# EAGLE design IRAMX-drv-v1 (EAGLE 6.5.0)
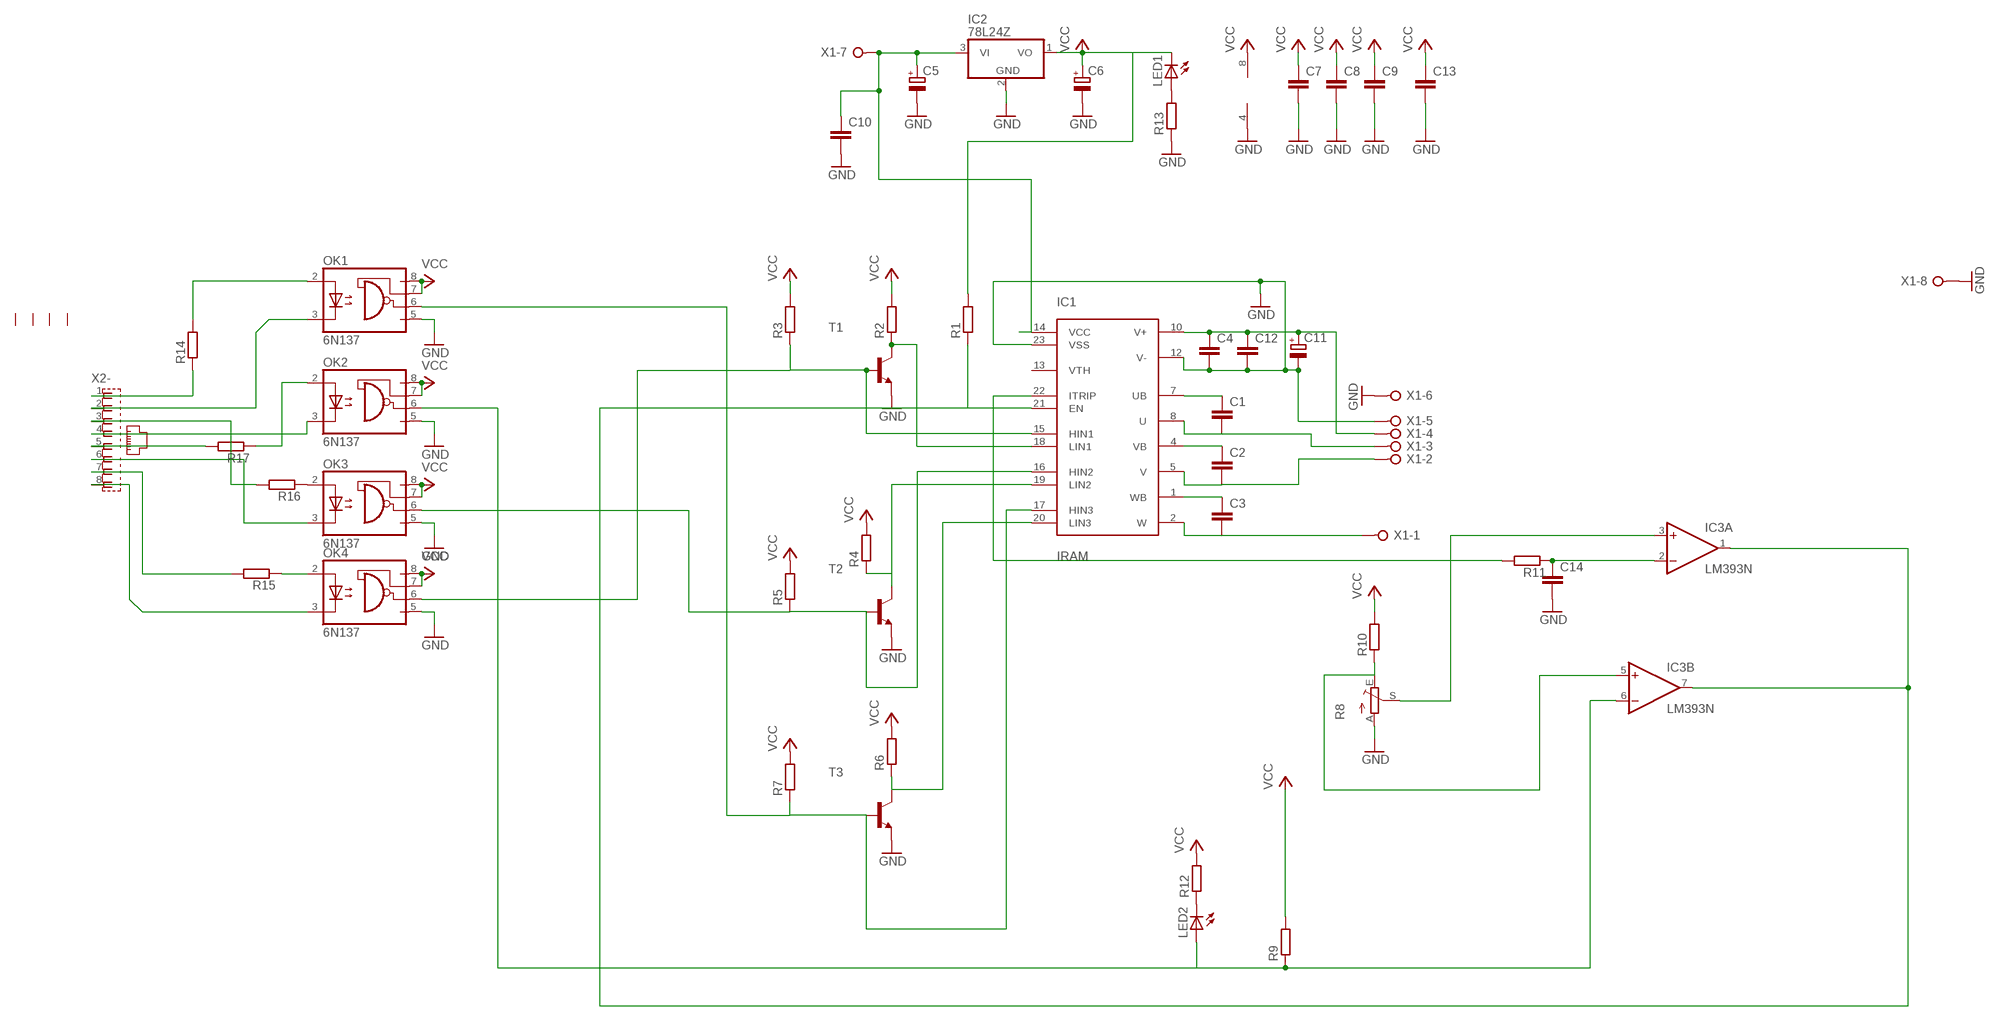
[diagram p0: schematic, sheet 1]

## Parts
C1  C5/5  [C5B5]
C2  C5/5  [C5B5]
C3  C5/5  [C5B5]
C4  C5/5  [C5B5]
C5  CPOL-EUE2.5-5  [E2,5-5]
C6  CPOL-EUE2.5-5  [E2,5-5]
C7  C-EU050-025X075  [C050-025X075]
C8  C-EU050-025X075  [C050-025X075]
C9  C-EU050-025X075  [C050-025X075]
C10  C-EU050-025X075  [C050-025X075]
C11  CPOL-EUE10-25  [EB25D]
C12  C-EU150-054X183  [C150-054X183]
C13  C-EU050-025X075  [C050-025X075]
C14  C-EU050-025X075  [C050-025X075]
IC1  IRAM  [SIP23]
IC2  78L24Z  [TO92]
IC3  LM393N  [DIL08]
LED1  LED5MM  [LED5MM]
LED2  LED5MM  [LED5MM]
OK1  6N137  [DIL08]
OK2  6N137  [DIL08]
OK3  6N137  [DIL08]
OK4  6N137  [DIL08]
R1  R-EU_0204/7  [0204/7]
R2  R-EU_0204/7  [0204/7]
R3  R-EU_0204/7  [0204/7]
R4  R-EU_0204/7  [0204/7]
R5  R-EU_0204/7  [0204/7]
R6  R-EU_0204/7  [0204/7]
R7  R-EU_0204/7  [0204/7]
R8  TRIM_EU-CA6V  [CA6V]
R9  R-EU_0204/7  [0204/7]
R10  R-EU_0204/7  [0204/7]
R11  R-EU_0204/7  [0204/7]
R12  R-EU_0204/7  [0204/7]
R13  R-EU_0204/7  [0204/7]
R14  R-EU_0204/2V  [0204V]
R15  R-EU_0204/2V  [0204V]
R16  R-EU_0204/2V  [0204V]
R17  R-EU_0204/2V  [0204V]
T1  BC547-NPN-TO92-CBE  [TO92-CBE]
T2  BC547-NPN-TO92-CBE  [TO92-CBE]
T3  BC547-NPN-TO92-CBE  [TO92-CBE]
X1  W237-08P  [W237-8P]
X2  RJ45  [RJ45]

## Nets
GND: C4.2 C5.- C6.- C7.2 C8.2 C9.2 C10.2 C11.- C12.2 C13.2 C14.2 IC1.12(V-) IC1.23(VSS) IC2.2(GND) IC3.4(P:V-) OK1.5(GND) OK2.5(GND) OK3.5(GND) OK4.5(GND) R8.A R13.1 T1.E T2.E T3.E X1.5 X1.6 X1.8
N$1: C1.1 IC1.7(UB)
N$2: C1.2 IC1.8(U) X1.3
N$3: C2.1 IC1.4(VB)
N$4: C2.2 IC1.5(V) X1.2
N$5: C3.1 IC1.1(WB)
N$6: C3.2 IC1.2(W) X1.1
N$7: LED2.K(C) R12.1
N$8: C14.1 IC3.2(A:-IN) R11.1
N$9: C5.+ C10.1 IC1.14(VCC) IC2.3(VI) X1.7
N$10: IC1.21(EN) IC3.1(A:OUT) IC3.7(B:OUT) R1.1
N$11: IC1.15(HIN1) OK4.6(VO) R3.1 T1.B
N$12: IC1.18(LIN1) R2.1 T1.C
N$13: IC1.19(LIN2) R4.1 T2.C
N$14: IC1.16(HIN2) OK3.6(VO) R5.1 T2.B
N$15: IC1.20(LIN3) R6.1 T3.C
N$16: OK3.3(C) X2.6
N$17: R16.2 X2.3
N$18: OK4.3(C) X2.8
N$19: OK2.3(C) X2.4
N$20: OK1.3(C) X2.2
N$21: OK1.2(A) R14.2
N$22: R17.2 X2.5
N$23: R15.2 X2.7
N$24: IC1.17(HIN3) OK1.6(VO) R7.1 T3.B
N$25: IC3.3(A:+IN) R8.S
N$26: IC1.22(ITRIP) R11.2
N$27: IC3.5(B:+IN) R8.E R10.1
N$28: LED1.A R13.2
N$29: IC3.6(B:-IN) LED2.A OK2.6(VO) R9.1
N$30: C4.1 C11.+ C12.1 IC1.10(V+) X1.4
N$31: R14.1 X2.1
N$32: OK4.2(A) R15.1
N$33: OK3.2(A) R16.1
N$34: OK2.2(A) R17.1
VCC: C6.+ C7.1 C8.1 C9.1 C13.1 IC2.1(VO) IC3.8(P:V+) LED1.K(C) OK1.7(VE) OK1.8(VCC) OK2.7(VE) OK2.8(VCC) OK3.7(VE) OK3.8(VCC) OK4.7(VE) OK4.8(VCC) R1.2 R2.2 R3.2 R4.2 R5.2 R6.2 R7.2 R9.2 R10.2 R12.2
Unconnected: IC1.13(VTH) X2.G1 X2.G2 X2.G3 X2.G4

## Library data of the parts
C1-C4 = capacitor-wima:C: CAPACITOR naming: grid - package width
C5 C6 C11 = rcl:CPOL-EU: POLARIZED CAPACITOR, European symbol
C7-C10 C12-C14 = rcl:C-EU: CAPACITOR, European symbol
IC1 = iram-b:IRAM
IC2 = linear:78*: Positive VOLTAGE REGULATOR Source: http://cache.national.com/ds/LM/LM78L05.pdf http://www.fairchildsemi.com/ds/LM/LM7805.pdf
IC3 = linear:LM393: COMPARATOR
LED1 LED2 = led:LED: LED OSRAM: - CHIPLED LG R971, LG N971, LY N971, LG Q971, LY Q971, LO R971, LY R971 LH N974, LH R974 LS Q976, LO Q976, LY Q976 LO Q996 - Hyper CHIPLED LW Q18S LB Q993, LB Q99A, LB R99A - SideLED LS A670, LO A670, LY A670, LG A670, LP A670 LB A673, LV A673, LT A673, LW A673 LH A674 LY A675 LS A676, LA A676, LO A676, LY A676, LW A676 LS A679, LY A679, LG A679 - Hyper Micro SIDELED® LS Y876, LA Y876, LO Y876, LY Y876 LT Y87S - SmartLED LW L88C, LW L88S LB L89C, LB L89S, LG L890 LS L89K, LO L89K, LY L89K LS L896, LA L896, LO L896, LY L896 - TOPLED LS T670, LO T670, LY T670, LG T670, LP T670 LSG T670, LSP T670, LSY T670, LOP T670, LYG T670 LG T671, LOG T671, LSG T671 LB T673, LV T673, LT T673, LW T673 LH T674 LS T676, LA T676, LO T676, LY T676, LB T676, LH T676, LSB T676, LW T676 LB T67C, LV T67C, LT T67C, LS T67K, LO T67K, LY T67K, LW E67C LS E67B, LA E67B, LO E67B, LY E67B, LB E67C, LV E67C, LT E67C LW T67C LS T679, LY T679, LG T679 LS T770, LO T770, LY T770, LG T770, LP T770 LB T773, LV T773, LT T773, LW T773 LH T774 LS E675, LA E675, LY E675, LS T675 LS T776, LA T776, LO T776, LY T776, LB T776 LHGB T686 LT T68C, LB T68C - Hyper Mini TOPLED® LB M676 - Mini TOPLED Santana® LG M470 LS M47K, LO M47K, LY M47K Source: http://www.osram.convergy.de LUXEON: - LUMILED® LXK2-PW12-R00, LXK2-PW12-S00, LXK2-PW14-U00, LXK2-PW14-V00 LXK2-PM12-R00, LXK2-PM12-S00, LXK2-PM14-U00 LXK2-PE12-Q00, LXK2-PE12-R00, LXK2-PE12-S00, LXK2-PE14-T00, LXK2-PE14-U00 LXK2-PB12-K00, LXK2-PB12-L00, LXK2-PB12-M00, LXK2-PB14-N00, LXK2-PB14-P00, LXK2-PB14-Q00 LXK2-PR12-L00, LXK2-PR12-M00, LXK2-PR14-Q00, LXK2-PR14-R00 LXK2-PD12-Q00, LXK2-PD12-R00, LXK2-PD12-S00 LXK2-PH12-R00, LXK2-PH12-S00 LXK2-PL12-P00, LXK2-PL12-Q00, LXK2-PL12-R00 Source: www.luxeon.com KINGBRIGHT: KA-3528ASYC Source: www.kingbright.com
OK1-OK4 = optocoupler:6N137: MOTOROLA OPTO COUPLER; MPN: 6N137; OC_FARNELL: 1328376; OC_NEWARK: 52M1895
R1-R7 R9-R17 = rcl:R-EU_: RESISTOR, European symbol
R8 = pot:TRIM_EU-: POTENTIOMETER
T1-T3 = transistor:*-NPN-: NPN Transistror BF959 corrected 2008.03.06
X1 = con-wago-508:W237-08P: WAGO SREW CLAMP; OC_FARNELL: unknown; OC_NEWARK: unknown
X2 = con-appsys:RJ45: AMP connector

## Board
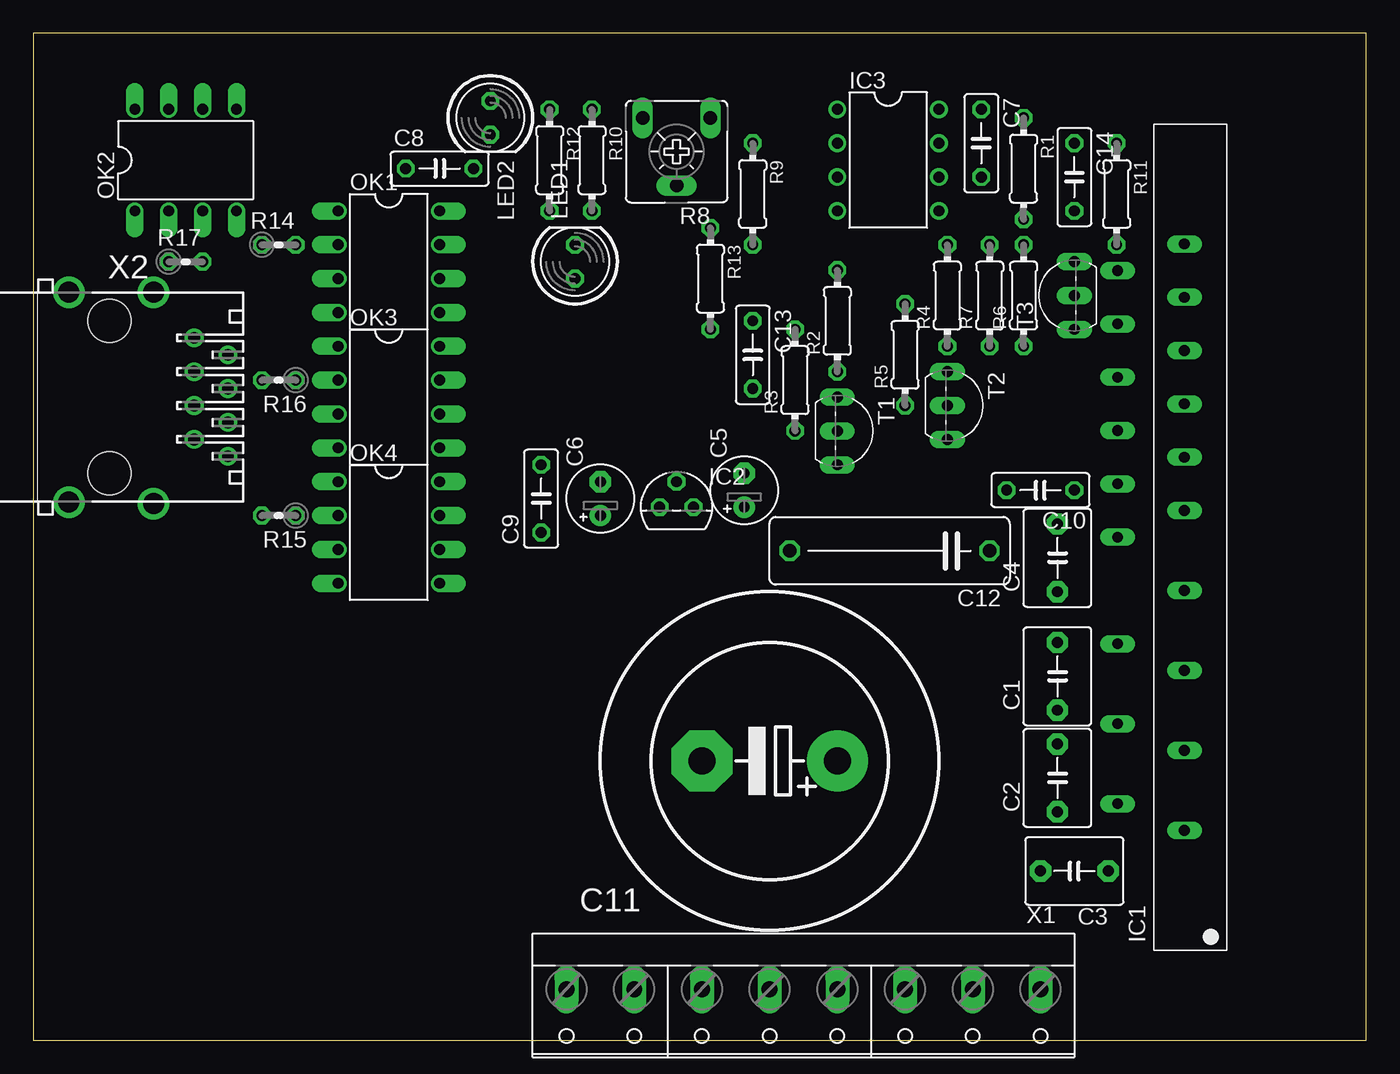
[diagram p1: board, top side]
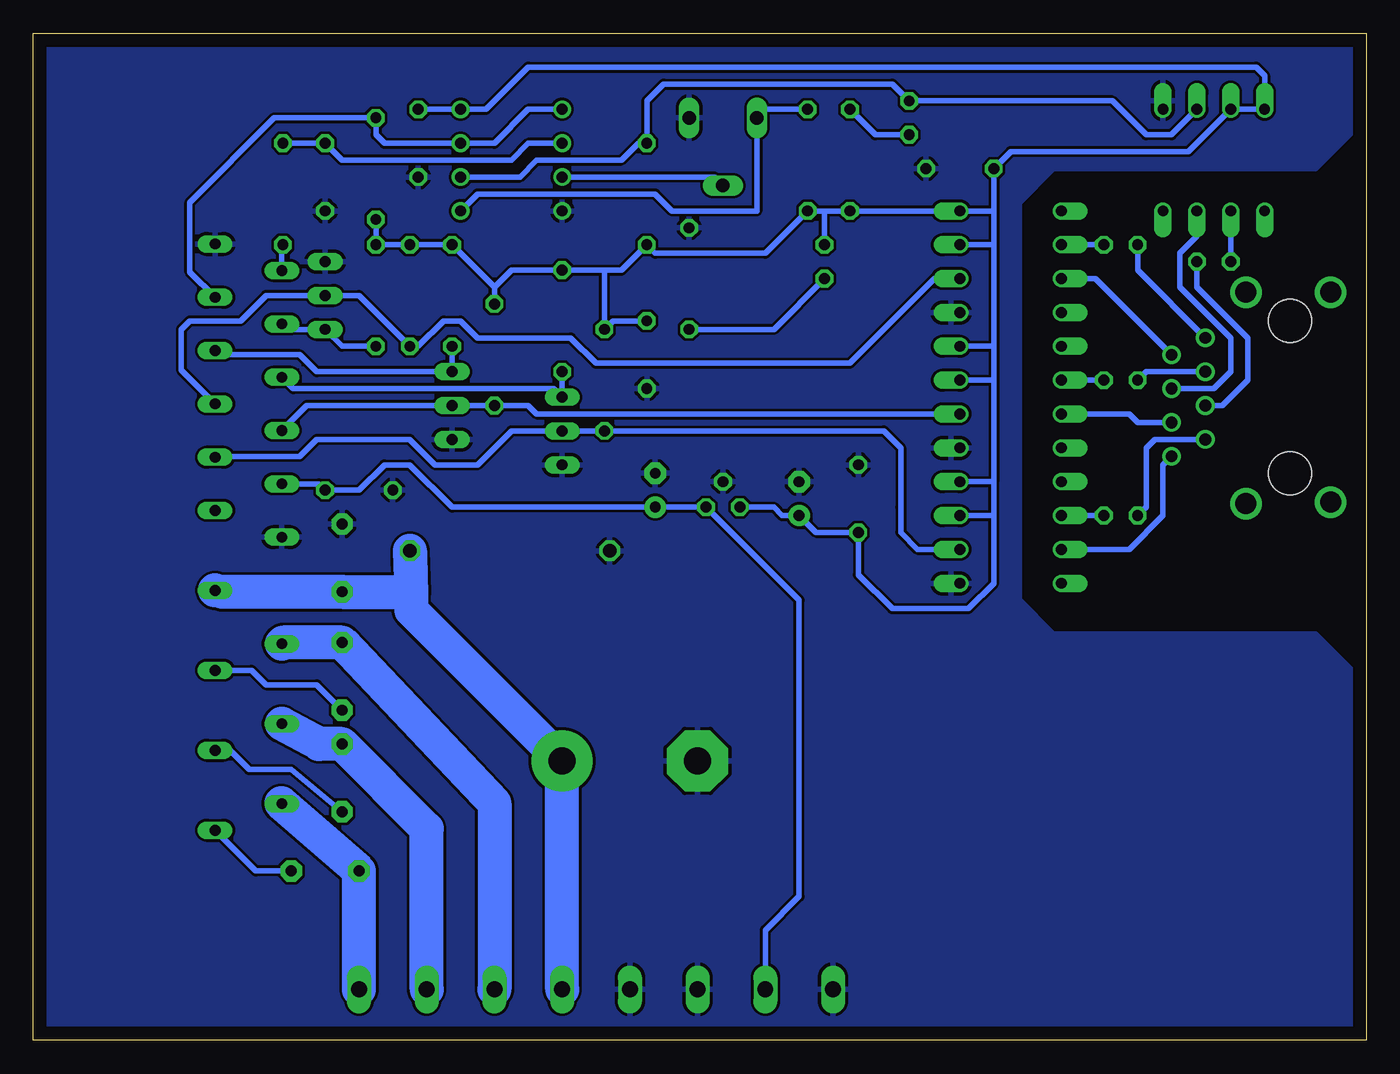
[diagram p2: board, bottom side, seen from below]

Size 100 x 75.56 mm. Coordinates in mm from the lower left corner, seen from the top.
Outline: 0,0 100,0 100,75.56 0,75.56 0,0
Copper layers (1*16): Top 0.035mm / dielectric 1.5mm / Bottom 0.035mm
Design rules "default": minimum track width 10mil, minimum drill 24mil, track to track 8mil, track to pad 8mil, pad to pad 8mil, via to via 8mil, smd to smd 8mil, copper to edge 40mil, drill to drill 8mil, minimum pad ring 10mil, minimum via ring 8mil, stop-mask expansion 4mil, vias tented up to drill 0mil, thermal gap 10mil

### Footprints (pad centres in the part's own frame; a part is rotated, then mirrored left to right if it is on the bottom)
C5B5 = drill 0.813 pad 1.6 octagon: 1 -2.54,0; 2 2.54,0
E2,5-5 = drill 0.813 pad 1.6: + -1.27,0 | drill 0.813 pad 1.6 octagon: - 1.27,0
C050-025X075 = drill 0.813 octagon: 1 -2.54,0; 2 2.54,0
EB25D = drill 2.007 pad 4.597: + -5.08,0 | drill 2.007 pad 4.597 octagon: - 5.08,0
C150-054X183 = drill 1.016 octagon: 1 -7.493,0; 2 7.493,0
SIP23 = drill 0.8 long: 1 -16,0; 2 -14,5; 4 -10,0; 5 -8,5; 7 -4,0; 8 -2,5; 10 2,0; 12 6,5; 13 8,0; 14 10,5; 15 12,0; 16 14,5; 17 16,0; 18 18,5; 19 20,0; 20 22,5; 21 24,0; 22 26,5; 23 28,0
TO92 = drill 0.813 octagon: 1 -1.27,0; 2 0,1.905; 3 1.27,0
DIL08 = drill 0.813 pad 1.27: 1 -3.81,-3.81; 2 -1.27,-3.81; 3 1.27,-3.81; 4 3.81,-3.81; 5 3.81,3.81; 6 1.27,3.81; 7 -1.27,3.81; 8 -3.81,3.81
LED5MM = drill 0.813 octagon: A -1.27,0; K 1.27,0
DIL08' = drill 0.813 offset: 1 -3.81,-3.81; 2 -1.27,-3.81; 3 1.27,-3.81; 4 3.81,-3.81; 5 3.81,3.81; 6 1.27,3.81; 7 -1.27,3.81; 8 -3.81,3.81
0204/7 = drill 0.813 octagon: 1 -3.81,0; 2 3.81,0
CA6V = drill 1.016 long: A -2.54,-2.54; E 2.54,-2.54; S 0,2.54
0204V = drill 0.813 octagon: 1 -1.27,0; 2 1.27,0
TO92-CBE = drill 0.813 long: B 0,0; C -2.54,0; E 2.54,0
W237-8P = drill 1.194 long: 1 -17.78,-0.635; 2 -12.7,-0.635; 3 -7.62,-0.635; 4 -2.54,-0.635; 5 2.54,-0.635; 6 7.62,-0.635; 7 12.7,-0.635; 8 17.78,-0.635
RJ45 = drill 0.889: 1 -4.445,6.35; 2 -3.175,8.89; 3 -1.905,6.35; 4 -0.635,8.89; 5 0.635,6.35; 6 1.905,8.89; 7 3.175,6.35; 8 4.445,8.89 | drill 1.575 pad 2.184: G1 -7.874,-3.048; G2 7.874,-3.048; G3 -7.874,3.302; G4 8.001,3.302 | hole 3.251: -5.715,0; 5.715,0

### Placement (x,y rotation side)
C1  76.83,27.3 90 top
C2  76.83,19.68 90 top
C3  78.11,12.7 180 top
C4  76.83,36.2 90 top
C5  53.34,41.27 90 top
C6  42.55,40.64 90 top
C7  71.12,67.31 270 top
C8  30.48,65.41 0 top
C9  38.1,40.64 90 top
C10  75.56,41.27 180 top
C11  55.24,20.95 180 top
C12  64.24,36.72 180 top
C13  53.98,51.44 270 top
C14  78.11,64.77 270 top
IC1  86.36,31.75 90 top
IC2  48.26,40.01 0 top
IC3  64.14,66.04 270 top
LED1  40.64,58.42 90 top
LED2  34.29,69.22 270 top
OK1  6N137  [DIL08']  26.67,58.42 270 top
OK2  6N137  [DIL08']  11.43,66.04 0 top
OK3  6N137  [DIL08']  26.67,48.26 270 top
OK4  6N137  [DIL08']  26.67,38.1 270 top
R1  74.3,65.41 270 top
R2  60.33,53.98 90 top
R3  57.15,49.53 90 top
R4  68.58,55.88 90 top
R5  65.41,51.44 90 top
R6  74.3,55.88 90 top
R7  71.75,55.88 90 top
R8  48.26,66.67 180 top
R9  53.98,63.5 270 top
R10  41.91,66.04 270 top
R11  81.28,63.5 270 top
R12  38.73,66.04 270 top
R13  50.8,57.15 270 top
R14  18.41,59.69 0 top
R15  18.41,39.37 180 top
R16  18.41,49.53 180 top
R17  11.43,58.42 0 top
T1  60.33,45.72 270 top
T2  68.58,47.62 270 top
T3  78.11,55.88 90 top
X1  57.78,3.17 180 top
X2  5.71,48.26 270 top

### Tracks (layer width: path | path; a pad name or v marks a point on that pad's centre or on a via)
GND
  pour Bottom: 0,75.56 100.33,75.56 100.33,0 0,0 0,26.67 3.81,30.48 23.5,30.48 26.04,33.02 26.04,62.87 23.5,65.41 3.81,65.41 0,69.22
N$1
  Bottom 0.406: IC1.7 83.63,27.75 82.55,26.67 78.74,26.67 C1.1
N$2
  Bottom 2.54: X1.3 65.41,17.78 C1.2 81.27,29.84 IC1.8
N$3
  Bottom 0.406: IC1.4 85.25,21.75 83.82,20.32 80.64,20.32 C2.1
N$4
  Bottom 2.54: X1.2 70.48,15.88 C2.2 78.56,22.23 IC1.5
N$5
  Bottom 0.406: C3.1 83.31,12.7 IC1.1
N$6
  Bottom 2.54: X1.1 C3.2 81.39,17.78 IC1.2
N$7
  Bottom 0.406: LED2.K 36.83,67.94 R12.1
N$8
  Bottom 0.406: R11.1 C14.1 76.83,66.04 64.14,66.04 62.87,67.31 IC3.2
N$9
  Bottom 0.406: IC1.14 78.58,41.75 C10.1 75.56,41.27 73.66,43.18 71.75,43.18 68.58,40.01 C5.+ IC2.3 42.55,33.02 42.55,10.79 45.09,8.26 X1.7
N$10
  Bottom 0.406: IC1.21 88.27,57.66 88.27,62.87 81.92,69.22 R1.1 74.3,67.94 73.66,67.31 IC3.7 65.41,67.31 62.87,69.85 IC3.1
N$11
  Bottom 0.406: IC1.15 85.16,43.81 80.01,43.81 78.74,45.09 71.75,45.09 69.85,43.18 66.67,43.18 64.14,45.72 T1.B R3.1 36.2,45.72 34.92,44.45 34.92,40.01 34.92,38.1 33.66,36.83 OK4.6
N$12
  Bottom 0.406: IC1.18 80.5,48.9 60.96,48.9 T1.C R2.1
N$13
  Bottom 0.406: IC1.19 86.05,51.44 80.01,51.44 78.74,50.16 T2.C R4.1
N$14
  Bottom 0.406: IC1.16 79.48,47.62 T2.B R5.1 62.87,47.62 62.23,46.99 OK3.6
N$15
  Bottom 0.406: IC1.20 80.95,53.34 T3.C 76.83,52.07 R6.1
N$16
  Bottom 0.406: OK3.3 17.78,46.99 17.14,46.35 X2.6
N$17
  Bottom 0.406: R16.2 16.51,50.16 X2.3
N$18
  Bottom 0.406: OK4.3 17.78,36.83 15.24,39.37 15.24,43.18 X2.8
N$19
  Bottom 0.406: X2.4 11.43,48.9 10.16,50.16 10.16,52.7 13.97,56.52 13.97,59.05 12.7,60.33 OK2.3
N$20
  Bottom 0.406: X2.2 20.32,57.15 OK1.3
N$21
  Bottom 0.406: OK1.2 R14.2
N$22
  Bottom 0.406: X2.5 10.79,47.62 8.89,49.53 8.89,52.7 12.7,56.52 R17.2
N$23
  Bottom 0.406: R15.2 16.51,40.01 16.51,44.45 15.88,45.09 X2.7
N$24
  Bottom 0.406: IC1.17 88.9,50.29 88.9,53.34 88.27,53.98 84.45,53.98 82.55,55.88 T3.B 75.56,55.88 R7.1 71.12,52.07 69.22,53.98 67.94,53.98 66.67,52.7 59.69,52.7 57.78,50.8 38.73,50.8 32.38,57.15 OK1.6
N$25
  Bottom 0.406: R8.S 48.9,64.77 IC3.3
N$26
  Bottom 0.406: IC1.22 81.36,59.61 R11.2
N$27
  Bottom 0.406: R10.1 45.09,69.85 R8.E 45.72,62.23 52.07,62.23 53.34,63.5 66.67,63.5 IC3.5
N$28
  Bottom 0.406: LED1.A 44.45,53.34 R13.2
N$29
  Bottom 0.406: OK2.6 14.61,67.94 16.51,67.94 19.05,70.48 LED2.A 35.56,71.75 52.7,71.75 53.98,70.48 R9.1 54.61,67.31 55.88,66.04 62.23,66.04 63.5,64.77 IC3.6
N$30
  Bottom 2.54: IC1.10 85.82,33.66 C4.1 71.63,33.66 C12.1 71.65,32.28 C11.+ X1.4
N$31
  Bottom 0.406: R14.1 17.14,57.78 X2.1
N$32
  Bottom 0.406: OK4.2 R15.1
N$33
  Bottom 0.406: OK3.2 R16.1
N$34
  Bottom 0.406: OK2.2 R17.1
VCC
  Bottom 0.406: 27.94,62.23 27.94,59.69 | 27.94,59.69 27.94,52.07 | 27.94,52.07 27.94,49.53 | 27.94,49.53 27.94,41.91 | 27.94,62.23 C8.1 26.67,66.67 13.34,66.67 OK2.7 OK2.8 7.62,72.39 8.26,73.03 62.87,73.03 66.04,69.85 IC3.8 C7.1 | 27.94,62.23 OK1.8 R12.2 40.64,62.23 | OK1.7 27.94,59.69 | OK3.8 27.94,52.07 | OK3.7 27.94,49.53 | OK4.8 27.94,41.91 | 57.15,57.78 R3.2 56.52,53.98 C13.1 | 65.41,56.52 64.14,57.78 R2.2 57.15,57.78 | R5.2 65.41,56.52 | 65.41,56.52 R4.2 R7.2 R6.2 R1.2 | 40.64,62.23 R10.2 45.09,59.05 53.34,59.05 R9.2 55.88,57.78 57.15,57.78 | 27.94,39.37 27.94,34.29 29.84,32.38 35.56,32.38 38.1,34.92 C9.1 41.27,38.1 C6.+ 43.81,39.37 44.45,40.01 IC2.1 | 27.94,39.37 27.94,41.91 | OK4.7 27.94,39.37 | LED1.K 40.64,62.23